# Altium schematic sheet WiFi_module_main.SchDoc
size A3
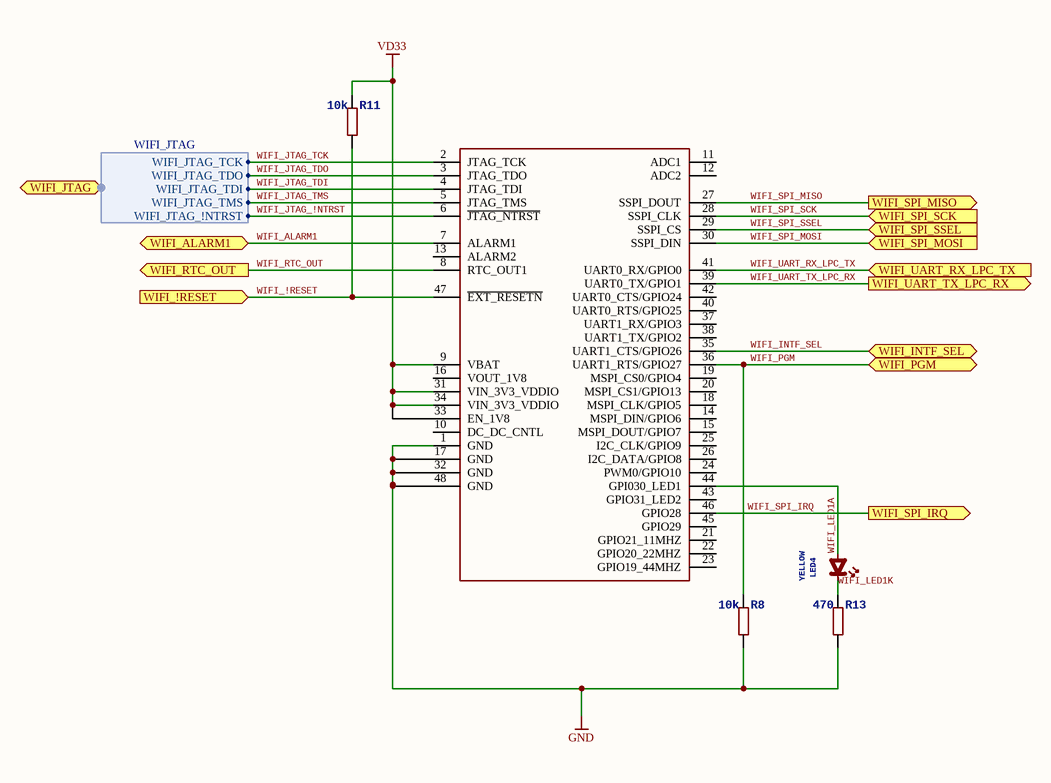
[diagram p0: WiFi_module_main.SchDoc]

## Parts
LED4  YELLOW  [0402_POLAR]
R8  10k  [0402]
R11  10k  [0402]
R13  470  [0402]
WIFI  GS1500M  [GAINSPANM]  (value not drawn)

## Ports
WIFI_!RESET (in), WIFI_ALARM1, WIFI_INTF_SEL, WIFI_JTAG (harness WIFI_JTAG), WIFI_PGM, WIFI_RTC_OUT (out), WIFI_SPI_IRQ (out), WIFI_SPI_MISO (out), WIFI_SPI_MOSI (in), WIFI_SPI_SCK (in), WIFI_SPI_SSEL (in), WIFI_UART_RX_LPC_TX (in), WIFI_UART_TX_LPC_RX (out)

## Harnesses
WIFI_JTAG: WIFI_JTAG_TCK, WIFI_JTAG_TDO, WIFI_JTAG_TDI, WIFI_JTAG_TMS, WIFI_JTAG_!NTRST

## Nets
GND: R8.1 R13.1 WIFI.1(GND) WIFI.17(GND) WIFI.32(GND) WIFI.48(GND)
VD33: R11.2 WIFI.9(VBAT) WIFI.31(VIN_3V3_VDDIO) WIFI.33(EN_1V8) WIFI.34(VIN_3V3_VDDIO)
WIFI_!RESET: R11.1 WIFI.47(~{EXT_RESETN}) ; port WIFI_!RESET
WIFI_ALARM1: WIFI.7(ALARM1) ; port WIFI_ALARM1
WIFI_INTF_SEL: WIFI.35(UART1_CTS/GPIO26) ; port WIFI_INTF_SEL
WIFI_JTAG_!NTRST: WIFI.6(~{JTAG_NTRST}) ; port WIFI_JTAG.WIFI_JTAG_!NTRST
WIFI_JTAG_TCK: WIFI.2(JTAG_TCK) ; port WIFI_JTAG.WIFI_JTAG_TCK
WIFI_JTAG_TDI: WIFI.4(JTAG_TDI) ; port WIFI_JTAG.WIFI_JTAG_TDI
WIFI_JTAG_TDO: WIFI.3(JTAG_TDO) ; port WIFI_JTAG.WIFI_JTAG_TDO
WIFI_JTAG_TMS: WIFI.5(JTAG_TMS) ; port WIFI_JTAG.WIFI_JTAG_TMS
WIFI_LED1A: LED4.A(ANODE) WIFI.44(GPI030_LED1)
WIFI_LED1K: LED4.K(CATHODE) R13.2
WIFI_PGM: R8.2 WIFI.36(UART1_RTS/GPIO27) ; port WIFI_PGM
WIFI_RTC_OUT: WIFI.8(RTC_OUT1) ; port WIFI_RTC_OUT
WIFI_SPI_IRQ: WIFI.46(GPIO28) ; port WIFI_SPI_IRQ
WIFI_SPI_MISO: WIFI.27(SSPI_DOUT) ; port WIFI_SPI_MISO
WIFI_SPI_MOSI: WIFI.30(SSPI_DIN) ; port WIFI_SPI_MOSI
WIFI_SPI_SCK: WIFI.28(SSPI_CLK) ; port WIFI_SPI_SCK
WIFI_SPI_SSEL: WIFI.29(SSPI_CS) ; port WIFI_SPI_SSEL
WIFI_UART_RX_LPC_TX: WIFI.41(UART0_RX/GPIO0) ; port WIFI_UART_RX_LPC_TX
WIFI_UART_TX_LPC_RX: WIFI.39(UART0_TX/GPIO1) ; port WIFI_UART_TX_LPC_RX

Not connected (* = marked no-connect by the designer): WIFI 10(DC_DC_CNTL) 11(ADC1) 12(ADC2) 13(ALARM2) 14(MSPI_DIN/GPIO6) 15(MSPI_DOUT/GPIO7) 16(VOUT_1V8) 18(MSPI_CLK/GPIO5) 19(MSPI_CS0/GPIO4) 20(MSPI_CS1/GPIO13) 21(GPIO21_11MHZ) 22(GPIO20_22MHZ) 23(GPIO19_44MHZ) 24(PWM0/GPIO10) 25(I2C_CLK/GPIO9) 26(I2C_DATA/GPIO8) 37(UART1_RX/GPIO3) 38(UART1_TX/GPIO2) 40(UART0_RTS/GPIO25) 42(UART0_CTS/GPIO24) 43(GPIO31_LED2) 45(GPIO29)

## Library data of the parts
LED4 = LED0402: LED common; SMD: Yes
R8 R11 R13 = R-EU_0402: RESISTOR; SMD: Yes
WIFI = GAINSPAN1500MXXGAINSPANMEXP: GAINSPAN WiFi module; SMD: Yes